# Altium schematic sheet MSP430.SchDoc
size A; SheetNumber: roneV11-msp430; SheetTotal: 6
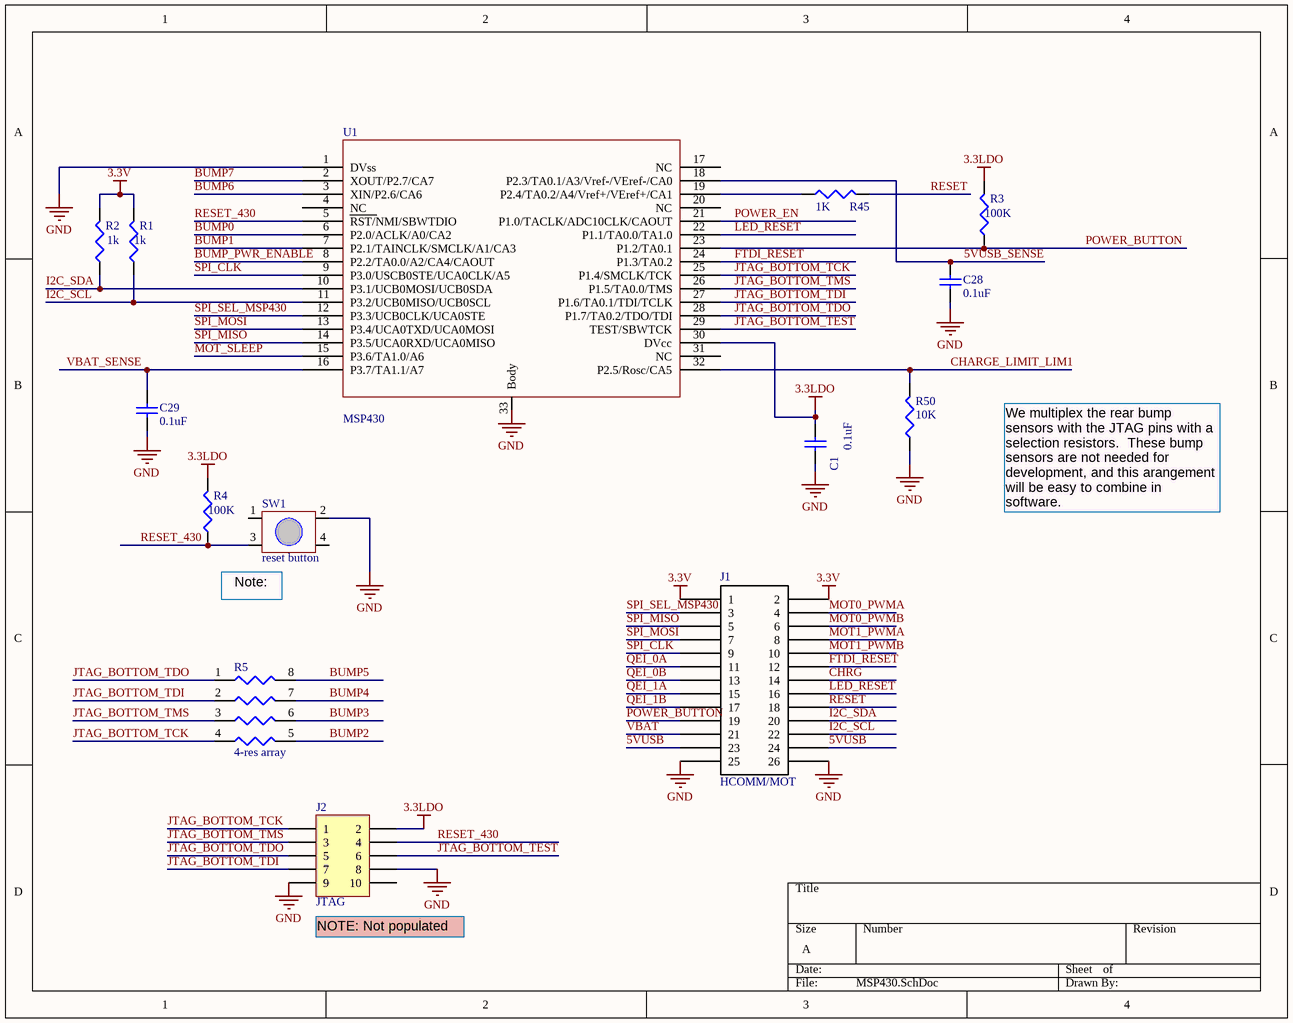
[diagram p0: MSP430.SchDoc]

## Parts
C1  value 0.1uF  [CAPC1005L]  (hidden comment: Cap Semi)
C28  value 0.1uF  [CAPC1005L]  (hidden comment: Cap Semi)
C29  value 0.1uF  [CAPC1005L]  (hidden comment: Cap Semi)
J1  HCOMM/MOT  [HeaderSM 13x2]
J2  JTAG  [HDR2X5]
R1  value 1k  [RESC1608L]  (hidden comment: Res3)
R2  value 1k  [RESC1608L]  (hidden comment: Res3)
R3  value 100K  [RESC1608L]  (hidden comment: Res3)
R4  value 100K  [RESC1608L]  (hidden comment: Res3)
R5  4-res array  [4-RES ARRAY]
R45  value 1K  [J1-0603]
R50  value 10K  [RESC1608L]  (hidden comment: Res3)
SW1  reset button  [SwitchTall-TL330]
U1  MSP430  [MSP430_32PIN]

## Nets
3.3LDO: C1.2 J2.2 R3.2 R4.2 U1.30(DVcc)
3.3V: J1.1 J1.2 R1.2 R2.2
GND: C1.1 C28.1 C29.1 J1.25 J1.26 J2.8 J2.9 R50.1 SW1.2 U1.1(DVss) U1.33(Body)
5VUSB: J1.23 J1.24
5VUSB_SENSE: C28.2 U1.18(P2.3/TA0.1/A3/Vref-/VEref-/CA0)
BUMP0: U1.6(P2.0/ACLK/A0/CA2)
BUMP1: U1.7(P2.1/TAINCLK/SMCLK/A1/CA3)
BUMP2: R5.5
BUMP3: R5.6
BUMP4: R5.7
BUMP5: R5.8
BUMP6: U1.3(XIN/P2.6/CA6)
BUMP7: U1.2(XOUT/P2.7/CA7)
BUMP_PWR_ENABLE: U1.8(P2.2/TA0.0/A2/CA4/CAOUT)
CHARGE_LIMIT_LIM1: R50.2 U1.32(P2.5/Rosc/CA5)
CHRG: J1.14
FTDI_RESET: J1.12 U1.24(P1.3/TA0.2)
I2C_SCL: J1.22 R1.1 U1.11(P3.2/UCB0MISO/UCB0SCL)
I2C_SDA: J1.20 R2.1 U1.10(P3.1/UCB0MOSI/UCB0SDA)
JTAG_BOTTOM_TCK: J2.1 R5.4 U1.25(P1.4/SMCLK/TCK)
JTAG_BOTTOM_TDI: J2.7 R5.2 U1.27(P1.6/TA0.1/TDI/TCLK)
JTAG_BOTTOM_TDO: J2.5 R5.1 U1.28(P1.7/TA0.2/TDO/TDI)
JTAG_BOTTOM_TEST: J2.6 U1.29(TEST/SBWTCK)
JTAG_BOTTOM_TMS: J2.3 R5.3 U1.26(P1.5/TA0.0/TMS)
LED_RESET: J1.16 U1.22(P1.1/TA0.0/TA1.0)
MOT0_PWMA: J1.4
MOT0_PWMB: J1.6
MOT1_PWMA: J1.8
MOT1_PWMB: J1.10
MOT_SLEEP: U1.15(P3.6/TA1.0/A6)
POWER_BUTTON: J1.19 R3.1 U1.23(P1.2/TA0.1)
POWER_EN: U1.21(P1.0/TACLK/ADC10CLK/CAOUT)
QEI_0A: J1.11
QEI_0B: J1.13
QEI_1A: J1.15
QEI_1B: J1.17
RESET: J1.18 R45.2
RESET_430: J2.4 R4.1 SW1.3 U1.5(RST/NMI/SBWTDIO)
SPI_CLK: J1.9 U1.9(P3.0/USCB0STE/UCA0CLK/A5)
SPI_MISO: J1.5 U1.14(P3.5/UCA0RXD/UCA0MISO)
SPI_MOSI: J1.7 U1.13(P3.4/UCA0TXD/UCA0MOSI)
SPI_SEL_MSP430: J1.3 U1.12(P3.3/UCB0CLK/UCA0STE)
VBAT: J1.21
VBAT_SENSE: C29.2 U1.16(P3.7/TA1.1/A7)
NetR45_1: R45.1 U1.19(P2.4/TA0.2/A4/Vref+/VEref+/CA1)

Not connected (* = marked no-connect by the designer): J2 10; SW1 1 4; U1 4(NC) 17(NC) 20(NC) 31(NC)

## Notes on the sheet
- We multiplex the rear bump sensors with the JTAG pins with a selection resistors.  These bump sensors are not needed for development, and this arangement will be easy to combine in software.
- Note: DNP
- (near J2) NOTE: Not populated

## Library data of the parts
C1 C28 C29 = Cap Semi: Capacitor (Semiconductor SIM Model); Published: 8-Jun-2000; LatestRevisionDate: 29-May-2009; LatestRevisionNote: IPC-7351 Footprint Added.; PackageReference: C1206; Publisher: Altium Limited; PackageDescription: Chip Capacitor
J1 = HCOMM/HMOT: Header, 2X20, 50mil, IDC
J2 = Header 5X2: Header, 5-Pin, Dual row; LatestRevisionDate: 17-Jul-2002; LatestRevisionNote: Re-released for DXP Platform.; Publisher: Altium Limited
R1-R4 R45 R50 = Res3: Resistor; Published: 8-Jun-2000; LatestRevisionDate: 29-May-2009; LatestRevisionNote: IPC-7351 Footprint Added.; PackageReference: J1-0603; Publisher: Altium Limited; PackageDescription: Chip Resistor
R5 = 4 Res Array
SW1 = Switch-TL330
U1 = MSP430_32pin